# EAGLE design Phototransistor2 (EAGLE 8.5.0)
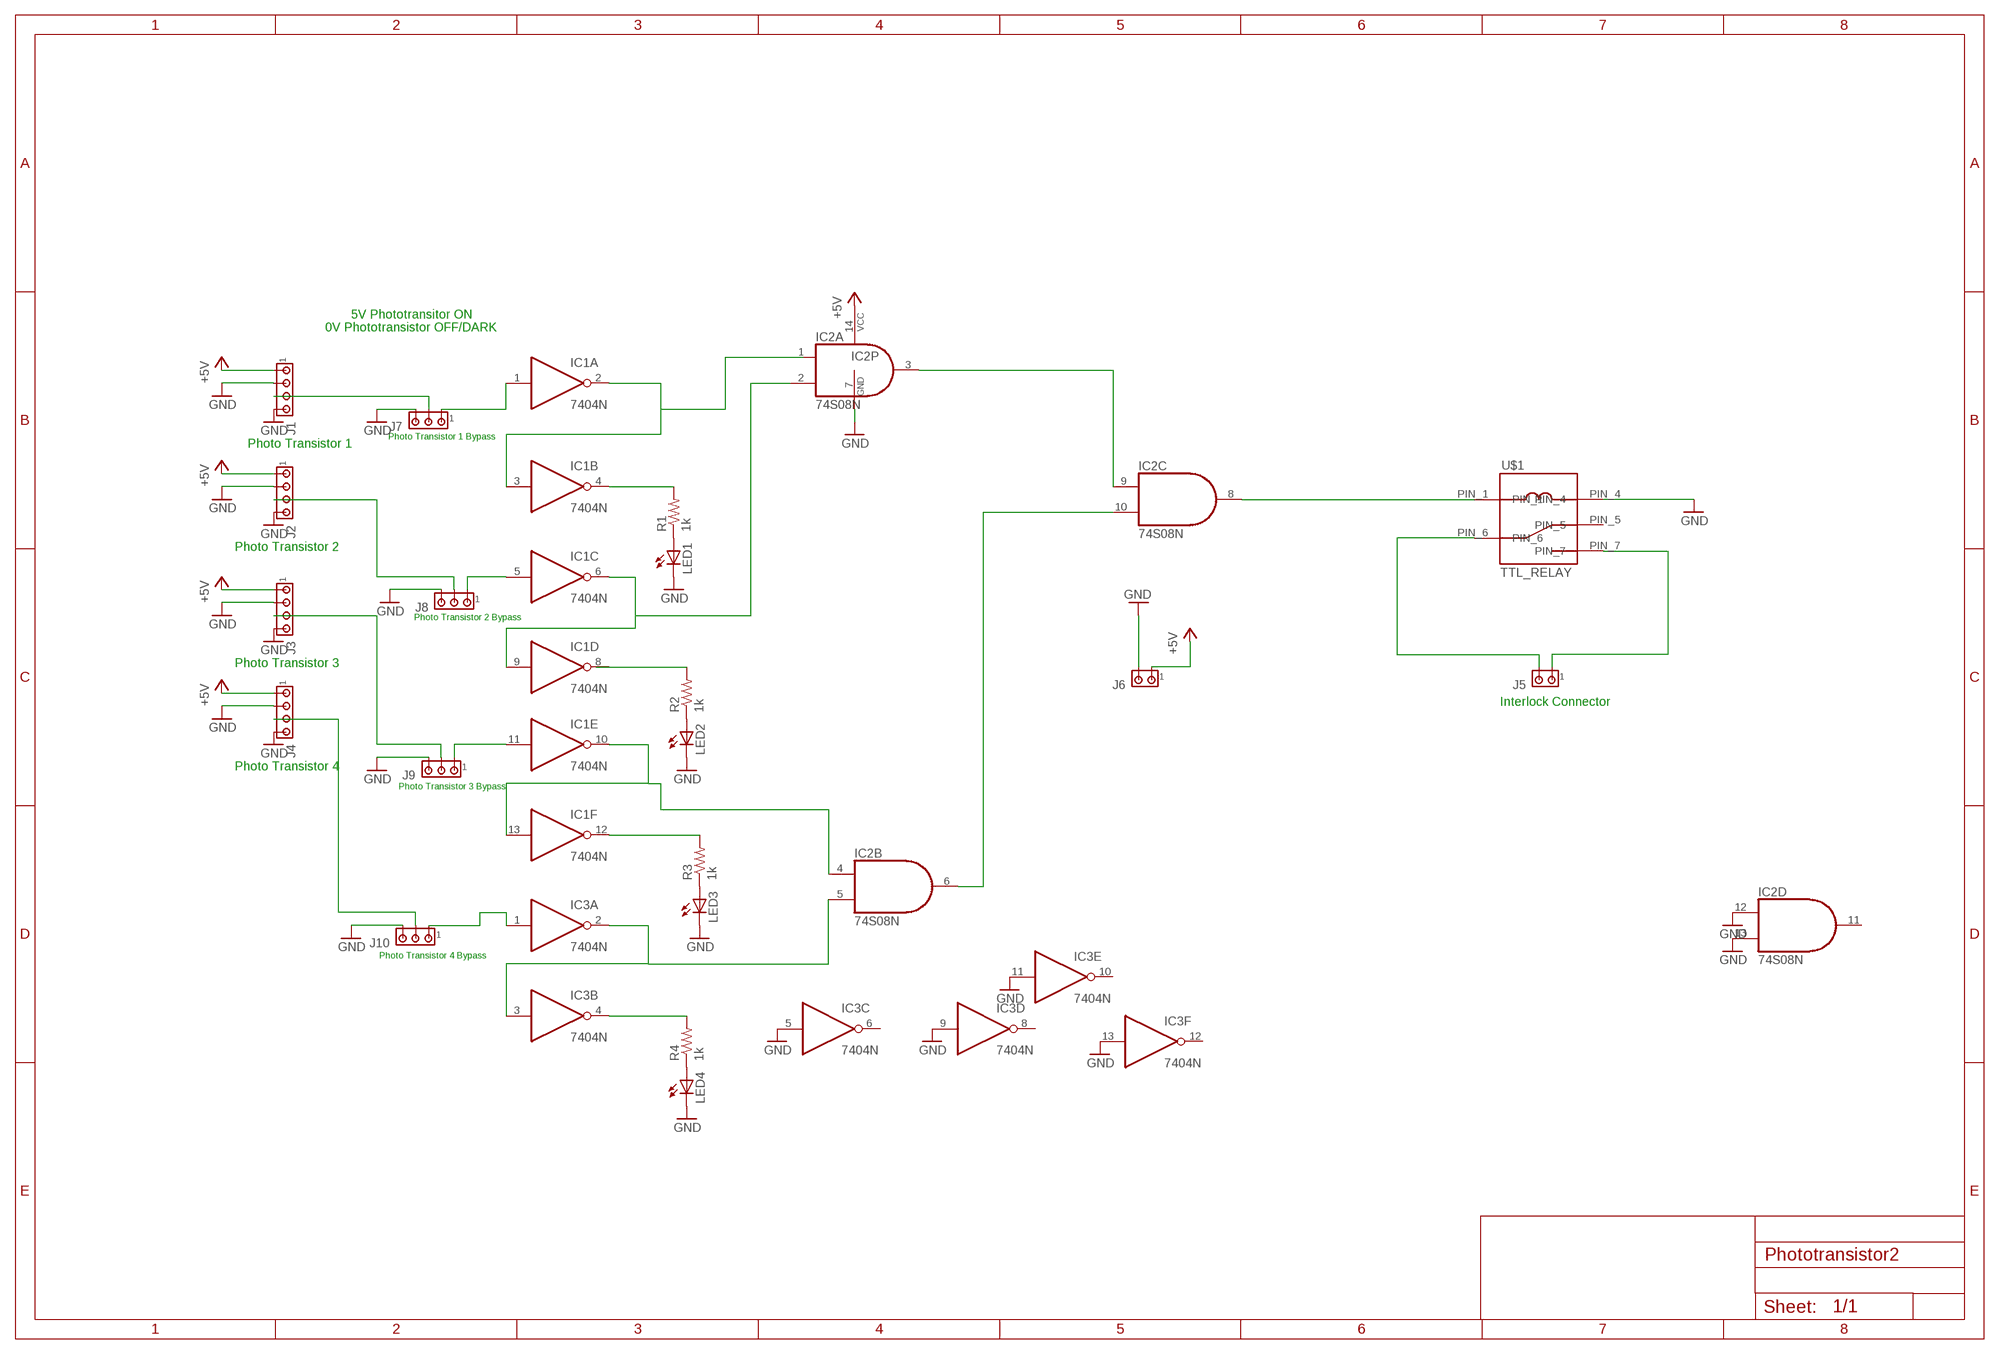
[diagram p0: schematic, sheet 1]

## Parts
IC1  7404N  [DIL14]
IC2  74S08N  [DIL14]
IC3  7404N  [DIL14]
J1  MTA04-100  [10X04MTA]
J2  MTA04-100  [10X04MTA]
J3  MTA04-100  [10X04MTA]
J4  MTA04-100  [10X04MTA]
J5  MTA02-100  [10X02MTA]
J6  MTA02-100  [10X02MTA]
J7  MTA03-100  [10X03MTA]
J8  MTA03-100  [10X03MTA]
J9  MTA03-100  [10X03MTA]
J10  MTA03-100  [10X03MTA]
LED1  LED3MM  [LED3MM]
LED2  LED3MM  [LED3MM]
LED3  LED3MM  [LED3MM]
LED4  LED3MM  [LED3MM]
R1  1k  R-US_0204/7  [0204/7]
R2  1k  R-US_0204/7  [0204/7]
R3  1k  R-US_0204/7  [0204/7]
R4  1k  R-US_0204/7  [0204/7]
U$1  TTL_RELAY  [R1OS-E1Y1-J1.0K]

## Nets
+5V: IC2.14(P:VCC) J1.1 J2.1 J3.1 J4.1 J6.1
GND: IC2.7(P:GND) IC2.12(D:I0) IC2.13(D:I1) IC3.5(C:I) IC3.9(D:I) IC3.11(E:I) IC3.13(F:I) J1.2 J1.4 J2.2 J2.4 J3.2 J3.4 J4.2 J4.4 J6.2 J7.3 J8.3 J9.3 J10.3 LED1.K(C) LED2.K(C) LED3.K(C) LED4.K(C) U$1.PIN_4
N$1: IC1.1(A:I) J7.1
N$2: J2.3 J8.2
N$3: J3.3 J9.2
N$4: J4.3 J10.2
N$5: LED1.A R1.1
N$6: LED2.A R2.1
N$7: LED3.A R3.1
N$8: LED4.A R4.1
N$9: IC1.2(A:O) IC1.3(B:I)
N$10: IC1.4(B:O) R1.2
N$11: IC1.6(C:O) IC1.9(D:I) IC2.2(A:I1)
N$12: R2.2
N$13: IC1.10(E:O) IC1.13(F:I) IC2.4(B:I0)
N$14: IC1.12(F:O) R3.2
N$15: IC2.5(B:I1) IC3.2(A:O) IC3.3(B:I)
N$16: IC3.4(B:O) R4.2
N$17: IC2.6(B:O) IC2.10(C:I1)
N$18: IC2.3(A:O) IC2.9(C:I0)
N$19: IC2.8(C:O) U$1.PIN_1
N$20: J5.2 U$1.PIN_6
N$21: J5.1 U$1.PIN_7
N$22: IC3.1(A:I) J10.1
N$23: J1.3 J7.2
N$24: IC1.5(C:I) J8.1
N$26: IC1.11(E:I) J9.1
Unconnected: IC1.8(D:O) IC2.1(A:I0) IC2.11(D:O) IC3.6(C:O) IC3.8(D:O) IC3.10(E:O) IC3.12(F:O) U$1.PIN_5

## Notes on the sheet
- 5V Phototransitor ON
- 0V Phototransistor OFF/DARK
- Photo Transistor 1 Bypass
- Photo Transistor 1
- Photo Transistor 2
- Photo Transistor 2 Bypass
- Photo Transistor 3
- Interlock Connector
- Photo Transistor 4
- Photo Transistor 3 Bypass
- Photo Transistor 4 Bypass

## Power pins joined to a net without a drawn wire
GND: IC1.7(P:GND) IC3.7(P:GND)
VCC: IC1.14(P:VCC) IC3.14(P:VCC)

## Library data of the parts
IC1 IC3 = 74xx-us:74*04: Hex INVERTER
IC2 = 74xx-us:74*08: Quad 2-input AND gate
J1-J4 = con-amp:MTA04-100: AMP connector
J5 J6 = con-amp:MTA02-100: AMP connector
J7-J10 = con-amp:MTA03-100: AMP connector
LED1-LED4 = led:LED: LED OSRAM: - CHIPLED LG R971, LG N971, LY N971, LG Q971, LY Q971, LO R971, LY R971 LH N974, LH R974 LS Q976, LO Q976, LY Q976 LO Q996 - Hyper CHIPLED LW Q18S LB Q993, LB Q99A, LB R99A - SideLED LS A670, LO A670, LY A670, LG A670, LP A670 LB A673, LV A673, LT A673, LW A673 LH A674 LY A675 LS A676, LA A676, LO A676, LY A676, LW A676 LS A679, LY A679, LG A679 - Hyper Micro SIDELED® LS Y876, LA Y876, LO Y876, LY Y876 LT Y87S - SmartLED LW L88C, LW L88S LB L89C, LB L89S, LG L890 LS L89K, LO L89K, LY L89K LS L896, LA L896, LO L896, LY L896 - TOPLED LS T670, LO T670, LY T670, LG T670, LP T670 LSG T670, LSP T670, LSY T670, LOP T670, LYG T670 LG T671, LOG T671, LSG T671 LB T673, LV T673, LT T673, LW T673 LH T674 LS T676, LA T676, LO T676, LY T676, LB T676, LH T676, LSB T676, LW T676 LB T67C, LV T67C, LT T67C, LS T67K, LO T67K, LY T67K, LW E67C LS E67B, LA E67B, LO E67B, LY E67B, LB E67C, LV E67C, LT E67C LW T67C LS T679, LY T679, LG T679 LS T770, LO T770, LY T770, LG T770, LP T770 LB T773, LV T773, LT T773, LW T773 LH T774 LS E675, LA E675, LY E675, LS T675 LS T776, LA T776, LO T776, LY T776, LB T776 LHGB T686 LT T68C, LB T68C - Hyper Mini TOPLED® LB M676 - Mini TOPLED Santana® LG M470 LS M47K, LO M47K, LY M47K Source: http://www.osram.convergy.de LUXEON: - LUMILED® LXK2-PW12-R00, LXK2-PW12-S00, LXK2-PW14-U00, LXK2-PW14-V00 LXK2-PM12-R00, LXK2-PM12-S00, LXK2-PM14-U00 LXK2-PE12-Q00, LXK2-PE12-R00, LXK2-PE12-S00, LXK2-PE14-T00, LXK2-PE14-U00 LXK2-PB12-K00, LXK2-PB12-L00, LXK2-PB12-M00, LXK2-PB14-N00, LXK2-PB14-P00, LXK2-PB14-Q00 LXK2-PR12-L00, LXK2-PR12-M00, LXK2-PR14-Q00, LXK2-PR14-R00 LXK2-PD12-Q00, LXK2-PD12-R00, LXK2-PD12-S00 LXK2-PH12-R00, LXK2-PH12-S00 LXK2-PL12-P00, LXK2-PL12-Q00, LXK2-PL12-R00 Source: www.luxeon.com KINGBRIGHT: KA-3528ASYC Source: www.kingbright.com
R1-R4 = rcl:R-US_: RESISTOR, American symbol
U$1 = Anthony-Relay:TTL_RELAY

## Board
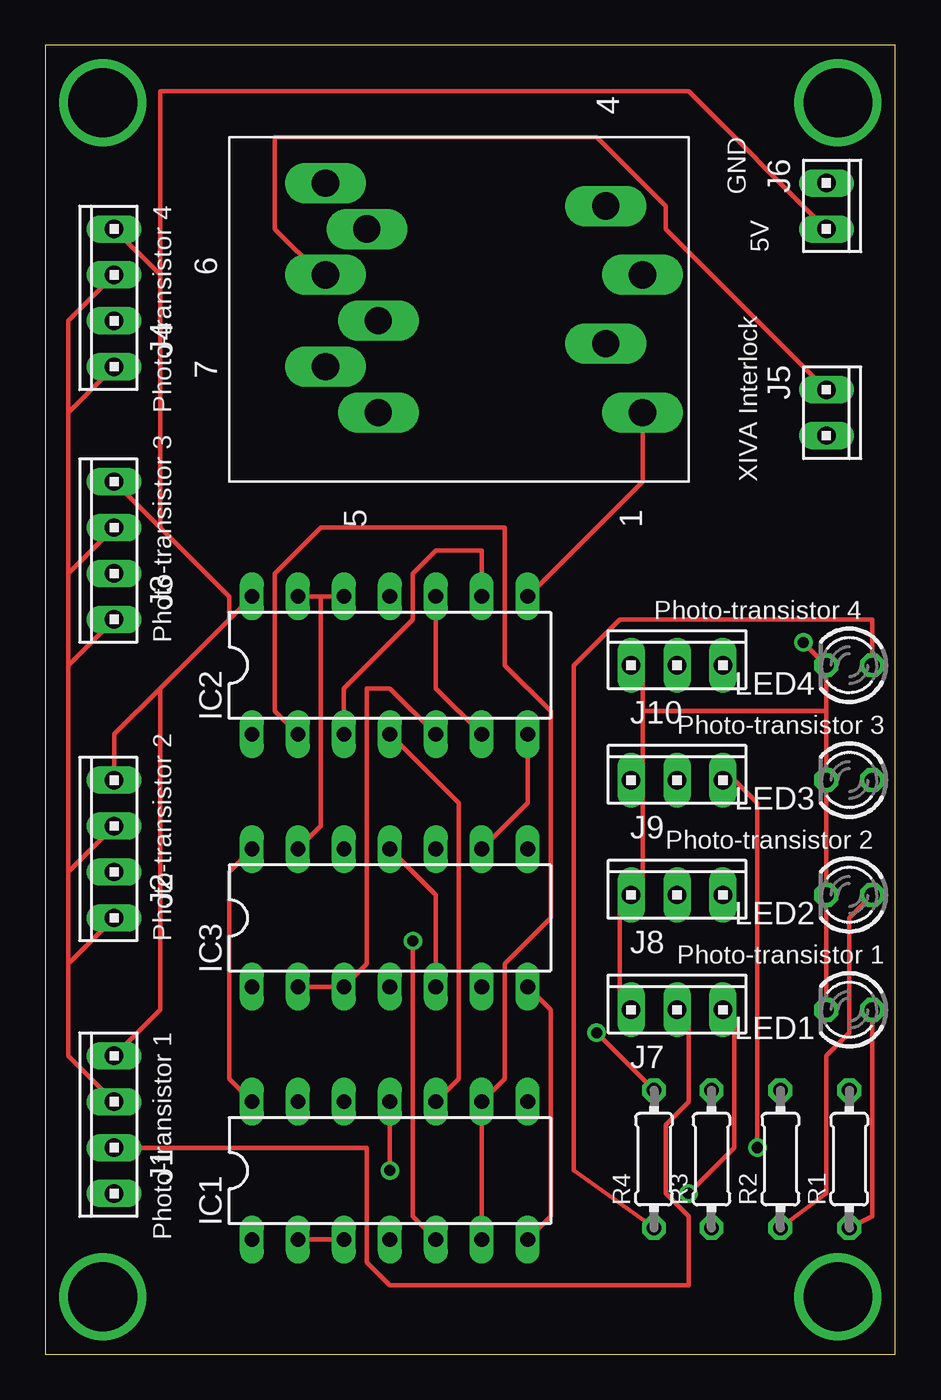
[diagram p1: board, top side]
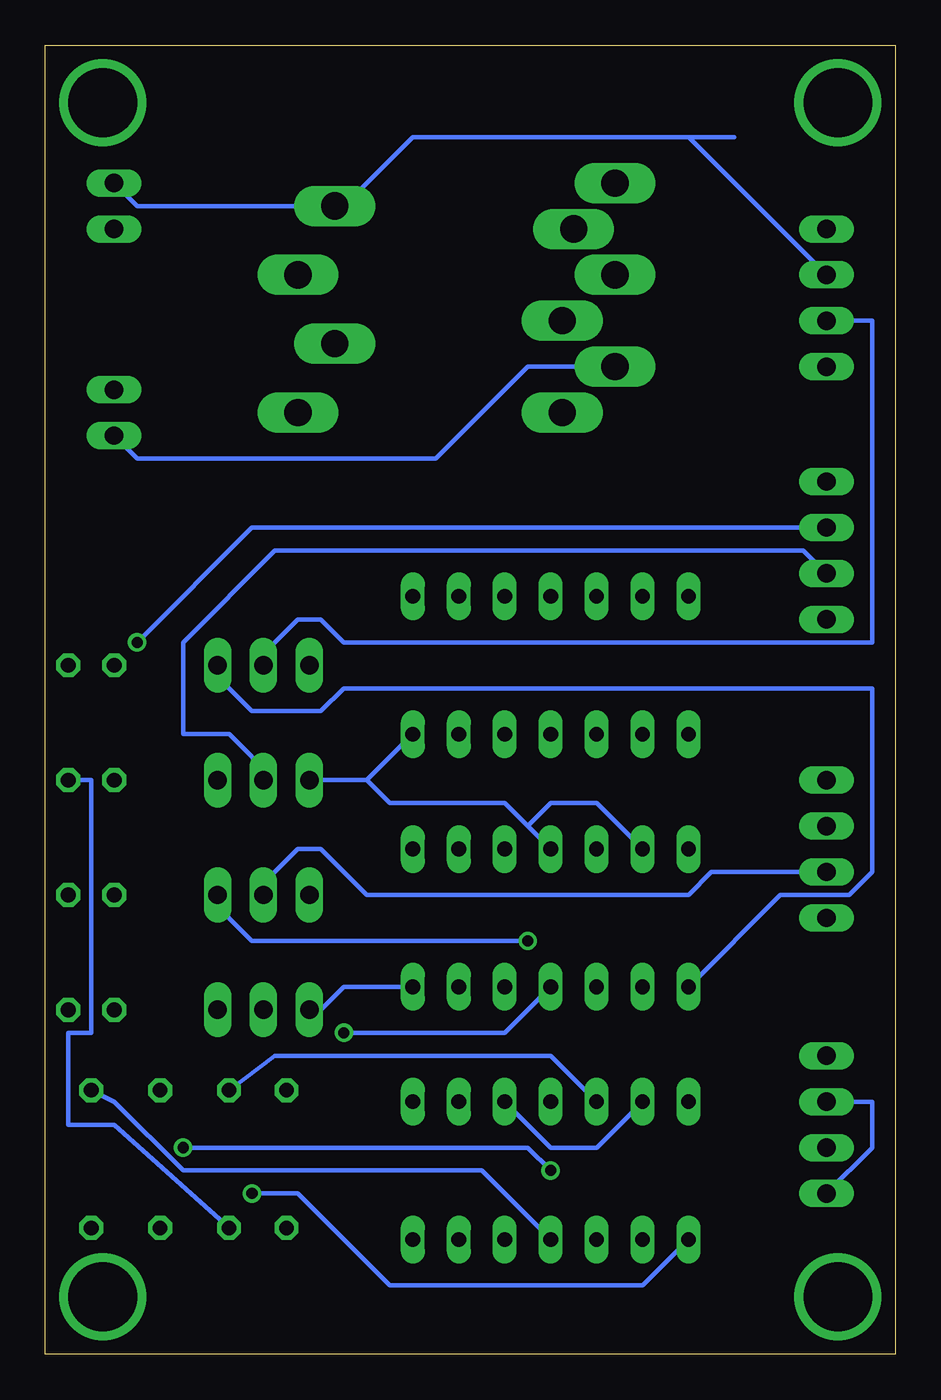
[diagram p2: board, bottom side, seen from below]

Size 46.99 x 72.39 mm. Coordinates in mm from the lower left corner, seen from the top.
Outline: 0,0 46.99,0 46.99,72.39 0,72.39 0,0
Copper layers (1*16): Top 0.035mm / dielectric 1.5mm / Bottom 0.035mm
Design rules "default": minimum track width 10mil, minimum drill 24mil, track to track 8mil, track to pad 8mil, pad to pad 8mil, via to via 8mil, smd to smd 8mil, copper to edge 40mil, drill to drill 8mil, minimum pad ring 10mil, minimum via ring 8mil, stop-mask expansion 4mil, vias tented up to drill 0mil, thermal gap 10mil

### Footprints (pad centres in the part's own frame; a part is rotated, then mirrored left to right if it is on the bottom)
DIL14 = drill 0.813 long: 1 -7.62,-3.81; 2 -5.08,-3.81; 3 -2.54,-3.81; 4 0,-3.81; 5 2.54,-3.81; 6 5.08,-3.81; 7 7.62,-3.81; 8 7.62,3.81; 9 5.08,3.81; 10 2.54,3.81; 11 0,3.81; 12 -2.54,3.81; 13 -5.08,3.81; 14 -7.62,3.81
10X04MTA = drill 1.016 long: 1 3.81,0; 2 1.27,0; 3 -1.27,0; 4 -3.81,0
10X02MTA = drill 1.016 long: 1 1.27,0; 2 -1.27,0
10X03MTA = drill 1.016 long: 1 2.54,0; 2 0,0; 3 -2.54,0
LED3MM = drill 0.813 octagon: A -1.27,0; K 1.27,0
0204/7 = drill 0.813 octagon: 1 -3.81,0; 2 3.81,0
R1OS-E1Y1-J1.0K = drill 1.5 long: 89 8.89,17.145; P$2 7.62,4.572; P$3 11.43,2.54; P$9 13.97,17.78; P$10 16.51,20.066; PIN_1 3.81,2.54; PIN_4 15.24,4.572; PIN_5 3.81,17.145; PIN_6 11.43,20.066; PIN_7 6.35,20.066

### Placement (x,y rotation side)
IC1  19.05,10.16 0 top
IC2  19.05,38.1 0 top
IC3  19.05,24.13 0 top
J1  3.81,12.7 90 top
J2  3.81,27.94 90 top
J3  3.81,44.45 90 top
J4  3.81,58.42 90 top
J5  43.18,52.07 270 top
J6  43.18,63.5 270 top
J7  34.92,19.05 0 top
J8  34.92,25.4 0 top
J9  34.92,31.75 0 top
J10  34.92,38.1 0 top
LED1  44.45,19.05 180 top
LED2  44.45,25.4 180 top
LED3  44.45,31.75 180 top
LED4  44.45,38.1 180 top
R1  44.45,10.79 90 top
R2  40.64,10.79 90 top
R3  36.83,10.79 90 top
R4  33.66,10.79 90 top
U$1  35.56,48.26 90 top

### Tracks (layer width: path | path; a pad name or v marks a point on that pad's centre or on a via)
+5V
  Top 0.254: 6.35,36.83 3.81,34.29 J2.1 | 6.35,36.83 10.16,40.64 | 10.16,40.64 IC2.14 | J1.1 6.35,19.05 6.35,36.83 | 6.35,45.72 10.16,41.91 10.16,40.64 | 6.35,45.72 J3.1 | 6.35,59.69 J4.1 | 6.35,45.72 6.35,59.69 | J6.1 35.56,69.85 6.35,69.85 6.35,59.69
GND  (via drill 0.61)
  Top 0.254: IC1.7 27.94,7.62 27.94,19.05 IC3.7 | LED1.K LED2.K LED3.K 43.18,35.56 | IC3.5 21.59,25.4 IC3.11 | 15.24,41.91 IC2.12 | 15.24,41.91 IC2.13 | 15.24,41.91 15.24,29.21 IC3.13 | J7.3 31.75,19.05 31.75,25.4 J8.3 33.02,25.4 33.02,31.75 | 43.18,35.56 LED4.K v41.91,39.37 | IC3.9 26.67,30.48 IC2.7 | 33.02,35.56 33.02,31.75 | 33.02,35.56 33.02,38.1 J10.3 | 43.18,35.56 33.02,35.56 | 33.02,31.75 J9.3 | 1.27,21.59 J2.4 | 1.27,21.59 1.27,16.51 J1.2 | 1.27,26.67 J2.2 | 1.27,21.59 1.27,26.67 | 1.27,38.1 J3.4 | 1.27,26.67 1.27,38.1 | 1.27,43.18 J3.2 | 1.27,38.1 1.27,43.18 | 1.27,52.07 J4.4 | 1.27,43.18 1.27,52.07 | J4.2 1.27,57.15 1.27,52.07
  Bottom 0.254: IC3.7 30.48,20.32 31.75,19.05 J7.3 | J6.2 41.91,63.5 U$1.PIN_4 30.48,63.5 26.67,67.31 11.43,67.31 | 11.43,67.31 8.89,67.31 | 29.21,31.75 IC2.7 | J9.3 29.21,31.75 | 29.21,31.75 27.94,30.48 21.59,30.48 20.32,29.21 | 20.32,29.21 IC3.11 | 20.32,29.21 19.05,30.48 16.51,30.48 IC3.13 | J1.4 1.27,11.43 1.27,13.97 J1.2 | v41.91,39.37 35.56,45.72 J3.2 | J4.2 11.43,67.31
N$1  (via drill 0.61)
  Top 0.254: v35.56,8.89 38.1,11.43 38.1,19.05 J7.1
  Bottom 0.254: IC1.1 13.97,3.81 27.94,3.81 33.02,8.89 v35.56,8.89
N$2
  Bottom 0.254: J2.3 10.16,26.67 11.43,25.4 29.21,25.4 31.75,27.94 33.02,27.94 35.56,25.4 J8.2
N$3
  Bottom 0.254: J3.3 5.08,44.45 34.29,44.45 39.37,39.37 39.37,34.29 36.83,34.29 34.29,31.75 J9.2
N$4
  Bottom 0.254: J4.3 1.27,57.15 1.27,39.37 30.48,39.37 31.75,40.64 33.02,40.64 35.56,38.1 J10.2
N$5
  Top 0.254: R1.1 45.72,7.62 LED1.A
N$6
  Top 0.254: R2.1 43.18,8.89 43.18,16.51 44.45,17.78 44.45,24.13 LED2.A
N$7
  Bottom 0.254: R3.1 43.18,12.7 45.72,12.7 45.72,17.78 44.45,17.78 44.45,31.75 LED3.A
N$8
  Top 0.254: R4.1 29.21,10.16 29.21,38.1 31.75,40.64 45.72,40.64 LED4.A
N$9
  Top 0.254: IC1.2 IC1.3
N$10
  Bottom 0.254: IC1.4 22.86,10.16 39.37,10.16 43.18,13.97 R1.2
N$11
  Top 0.254: IC1.6 IC1.9 25.4,15.24 25.4,21.59 27.94,24.13 27.94,35.56 25.4,38.1 25.4,45.72 15.24,45.72 12.7,43.18 12.7,35.56 IC2.2
N$13
  Top 0.254: IC2.4 22.86,30.48 22.86,15.24 IC1.10
  Bottom 0.254: IC1.13 16.51,11.43 19.05,11.43 IC1.10
N$14
  Bottom 0.254: IC1.12 19.05,16.51 34.29,16.51 R3.2
N$15
  Top 0.254: IC3.2 IC3.3 17.78,21.59 17.78,36.83 19.05,36.83 IC2.5
N$16  (via drill 0.61)
  Top 0.254: v30.48,17.78 R4.2
  Bottom 0.254: IC3.4 21.59,17.78 v30.48,17.78
N$17
  Top 0.254: IC2.6 21.59,36.83 IC2.10
N$18
  Top 0.254: IC2.3 16.51,36.83 20.32,40.64 20.32,43.18 21.59,44.45 24.13,44.45 IC2.9
N$19
  Top 0.254: IC2.8 33.02,48.26 U$1.PIN_1
N$20
  Top 0.254: J5.2 34.29,62.23 34.29,63.5 30.48,67.31 12.7,67.31 12.7,62.23 15.24,59.69 U$1.PIN_6
N$21
  Bottom 0.254: J5.1 41.91,49.53 25.4,49.53 20.32,54.61 U$1.PIN_7
N$22
  Bottom 0.254: IC3.1 6.35,25.4 2.54,25.4 1.27,26.67 1.27,36.83 30.48,36.83 31.75,35.56 35.56,35.56 38.1,38.1 J10.1
N$23
  Top 0.254: J1.3 17.78,11.43 17.78,5.08 19.05,3.81 35.56,3.81 35.56,7.62 34.29,8.89 34.29,12.7 35.56,13.97 35.56,19.05 J7.2
N$24  (via drill 0.61)
  Top 0.254: IC1.5 20.32,7.62 v20.32,22.86
  Bottom 0.254: v20.32,22.86 35.56,22.86 38.1,25.4 J8.1
N$25  (via drill 3.8)
  other vias: 3.17,3.17
N$26  (via drill 0.61)
  Top 0.254: v19.05,10.16 IC1.11 | v39.37,11.43 39.37,30.48 38.1,31.75 J9.1
  Bottom 0.254: v19.05,10.16 20.32,11.43 v39.37,11.43
N$27  (via drill 3.8)
  other vias: 43.81,3.17
N$28  (via drill 3.8)
  other vias: 3.17,69.22
N$29  (via drill 3.8)
  other vias: 43.81,69.22
VCC
  Top 0.254: IC1.14 10.16,15.24 10.16,26.67 IC3.14

### Text on the board
tNames: GND | 5V | Photo-transistor 4 | XIVA Interlock | Photo-transistor 4 | Photo-transistor 3 | Photo-transistor 3 | Photo-transistor 2 | Photo-transistor 2 | Photo-transistor 1 | Photo-transistor 1